# Altium schematic sheet Sheet1___VL53L0X.SchDoc
size B
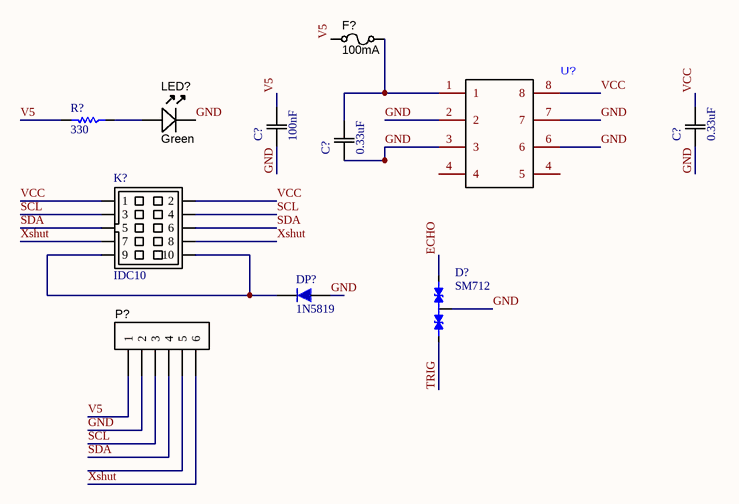
[diagram p0: Sheet1___VL53L0X.SchDoc]

## Parts
(Parts that share a designator on the sheet are numbered #1, #2 ... from top to bottom, then left to right.)
C?#1  100nF  [0805]
C?#2  0.33uF  [0805]
C?#3  0.33uF  [0805]
D?  SM712  [psm712]
DP?  1N5819  [430X270D]
F?  value 100mA  [RESC3216X70N]  (hidden comment: Slow-blow)
K?  IDC10  [IDC10-B]
LED?  Color: Green  [LED-0805-K]
P?  Header 6pin  [HDR1X6]  (value not drawn)  (no BOM)
R?  330  [RES 0805 (2012X06L)]
U?  (no value)  [78L05CD15V5V_LIB]

## Nets
ECHO: D?.1
GND: C?#1.1(C1) C?#2.1(C1) C?#3.1(C1) D?.3 DP?.1 LED?.K P?.2 U?.2 U?.3 U?.6 U?.7
SCL: K?.3 K?.4 P?.3
SDA: K?.5 K?.6 P?.4
TRIG: D?.2
V5: C?#1.2(C2) F?.2 P?.1 R?.2
VCC: C?#2.2(C2) K?.1 K?.2 U?.8
Xshut: K?.7 K?.8 P?.6
NetC?#3_2: C?#3.2(C2) F?.1 U?.1
NetDP?_2: DP?.2 K?.9 K?.10
NetLED?_A: LED?.A R?.1

Not connected (* = marked no-connect by the designer): P? 5; U? 4

## Library data of the parts
C?#1-C?#3 = CAP 470nF 50V: CAP CER 0.1UF 50V X7R 0805; Value: 470nF; Tolerance: 10%; Package: 0805; Rating: 50V
D? = SM712.TC: Asymmetrical TVS Diode for  Extended Common-Mode RS-485; Manufacturer: SEMTECH; Link to Datasheet: *; Link to Picture: *; Operating Temp: -55 to 125 °C; Storage Temp: -55 to 150 °C; ComponentLink1Description: *; ComponentLink1URL: *; Manufacture Part #: SM712.TC; Value: SM712
DP? = 1N5819: Schottkey Rectifiers; Designer: Abbas Basereh; Data: 16-12-2016; Link: *; Part. No: *
F? = FUSE_160mA_1206: Fuse 160mA 63VDC 1206 SMD; Manufacturer 1: Holly Fuse; Manufacturer Part Number 1: 12T-0160L; Ratings: 160mA; 63VDC; slow-blow; SCDType: spec; Package / Case: 1206 (3216 metric)
K? = IDC10: BOXHEADER 10 PIN; Manufacturer: Assmann Electronics Inc; Manufacturer Part Number: AWHW10G-0202-T-R; Connector Type: Header, Shrouded; Number of Positions: 10; Number of Positions Loaded: All; Pitch: 0.100" (2.54mm); Supplier 1: Digi-Key; Supplier Part Number 1: HRP10H-ND; Supplier: Digi-Key; Contact Type: Male Pin; RoHS: RoHS Compliant; Supplier Part Number: HRP10H-ND; Category: Connectors, Interconnects; Number of Rows: 2; Row Spacing: 0.100" (2.54mm); Contact Mating Length: -; Mounting Type: Through Hole; Termination: Solder; Fastening Type: -; Features: -; Contact Finish: Gold; Contact Finish Thickness: Flash; Color: Gray; Packaging: Tray
LED? = LED_SMD_Green_0805_6mcd: LED, 0805 SMD, Green; Manufacturer 1: LITE-ON; Manufacturer Part Number 1: LTST-C171GKT; Material: GaP; Ratings: 6 mcd; 569 nm; SCDType: source; Package / Case: 0805; Supplier 1: Digi-Key; Supplier Part Number 1: 160-1423-1-ND; Value: Green
P? = Header6P: Header, 6-pin
R? = Resistor: Tolerance: 5%; Power: 1/8 W; Value: 330
U? = MC78L05ACDG 5V Regulator